# EAGLE schematic Analog4_OLED (EAGLE 7.5.0)
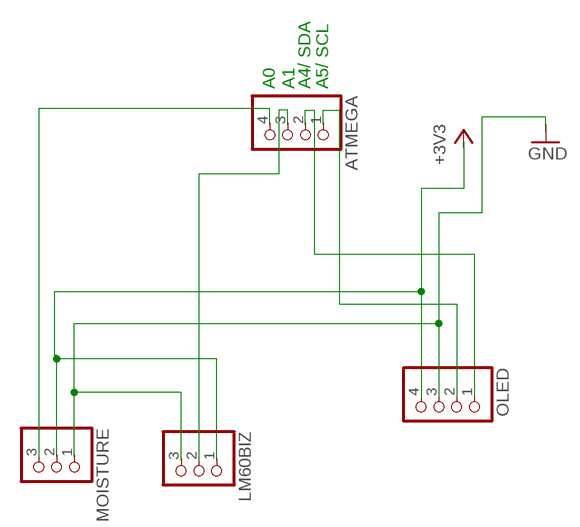
[diagram p0: schematic, sheet 1]

## Parts
ATMEGA  PINHD-1X4  [1X04]
LM60BIZ  PINHD-1X3  [1X03]
MOISTURE  PINHD-1X3  [1X03]
OLED  PINHD-1X4  [1X04]
Unconnected: ATMEGA.1 ATMEGA.2 ATMEGA.3 ATMEGA.4 LM60BIZ.1 LM60BIZ.2 LM60BIZ.3 MOISTURE.1 MOISTURE.2 MOISTURE.3 OLED.1 OLED.2 OLED.3 OLED.4

## Notes on the sheet
- A0 | A1 | A4/ SDA | A5/ SCL

## Library data of the parts
ATMEGA OLED = pinhead:PINHD-1X4: PIN HEADER
LM60BIZ MOISTURE = pinhead:PINHD-1X3: PIN HEADER